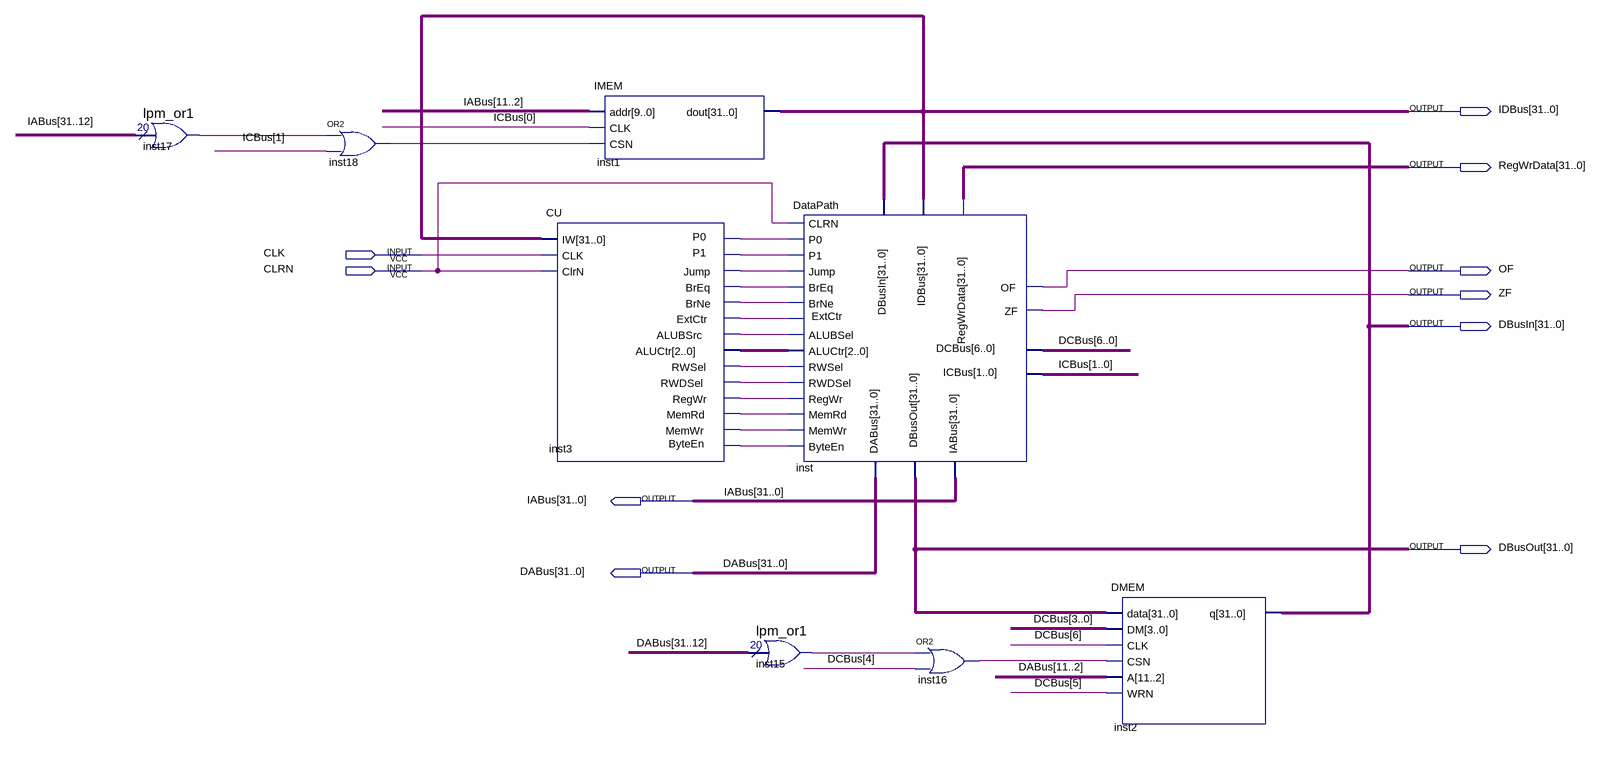
[diagram p0: schematic sheet]
// Quartus schematic CO-MIPS32.bdf as structural Verilog: 8 symbols, 10 pins
module \CO-MIPS32  (
  input  CLK,
  input  CLRN,
  output [31:0] IDBus,
  output [31:0] RegWrData,
  output OF,
  output ZF,
  output [31:0] DBusIn,
  output [31:0] IABus,
  output [31:0] DBusOut,
  output [31:0] DABus
);

  wire inst3_alubsrc, inst3_breq, inst3_brne, inst3_byteen, inst3_extctr, inst3_jump, inst3_memrd,
       inst3_memwr, inst3_p0, inst3_p1, inst3_regwr, inst3_rwdsel, inst3_rwsel, inst15_result, inst16_out,
       inst17_result, inst18_out;
  wire [1:0] ICBus;
  wire [2:0] inst3_aluctr;
  wire [6:0] DCBus;

  lpm_or1 inst17 (.data(IABus[31:12]), .result(inst17_result));
  or inst18 (inst18_out, inst17_result, ICBus[1]);
  CU inst3 (
    .IW(IDBus), .CLK(CLK), .ClrN(CLRN), .Jump(inst3_jump), .BrEq(inst3_breq), .BrNe(inst3_brne),
    .ExtCtr(inst3_extctr), .ALUBSrc(inst3_alubsrc), .ALUCtr(inst3_aluctr), .RWSel(inst3_rwsel),
    .RWDSel(inst3_rwdsel), .RegWr(inst3_regwr), .MemRd(inst3_memrd), .MemWr(inst3_memwr), .P0(inst3_p0),
    .P1(inst3_p1), .ByteEn(inst3_byteen));
  IMEM inst1 (.addr(IABus[11:2]), .CLK(ICBus[0]), .CSN(inst18_out), .dout(IDBus));
  lpm_or1 inst15 (.data(DABus[31:12]), .result(inst15_result));
  DataPath inst (
    .RWSel(inst3_rwsel), .ALUBSel(inst3_alubsrc), .ALUCtr(inst3_aluctr), .RegWr(inst3_regwr), .P0(inst3_p0),
    .CLRN(CLRN), .RWDSel(inst3_rwdsel), .DBusIn(DBusIn), .ByteEn(inst3_byteen), .MemRd(inst3_memrd),
    .MemWr(inst3_memwr), .P1(inst3_p1), .ExtCtr(inst3_extctr), .BrEq(inst3_breq), .BrNe(inst3_brne),
    .Jump(inst3_jump), .IDBus(IDBus), .OF(OF), .ZF(ZF), .DCBus(DCBus), .DABus(DABus), .DBusOut(DBusOut),
    .IABus(IABus), .ICBus(ICBus), .RegWrData(RegWrData));
  or inst16 (inst16_out, inst15_result, DCBus[4]);
  DMEM inst2 (
    .data(DBusOut), .DM(DCBus[3:0]), .CLK(DCBus[6]), .CSN(inst16_out), .A(DABus[11:2]), .WRN(DCBus[5]),
    .q(DBusIn));
endmodule
